# Altium schematic sheet Sheet1.SchDoc
size A4
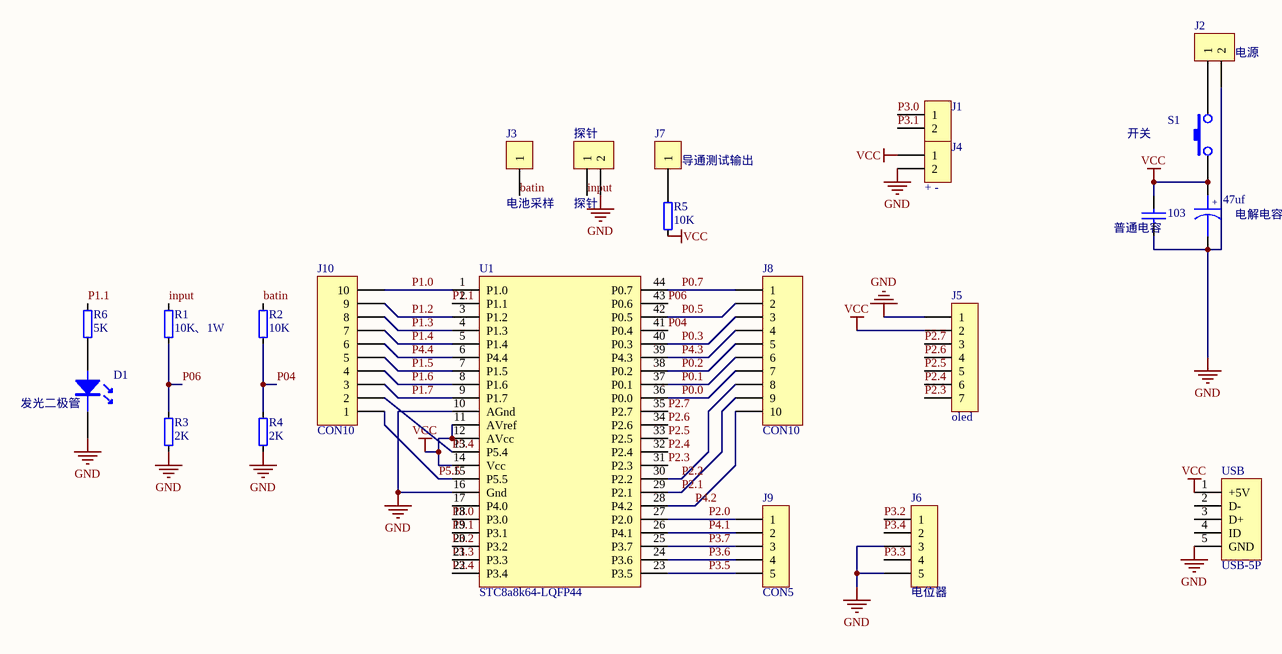
[diagram p0: Sheet1.SchDoc]

## Parts
47uf  电解电容  [电解电容直插]
103  普通电容  [瓷片电容直插]
D1  发光二极管  [LED]
J1  rxtx  [HDR2.54-LI-2P]
J2  电源  [HDR2.54-LI-2P]
J3  电池采样  [1pin排针]
J4  + -  [HDR2.54-LI-2P]
J5  oled  [7pin排针]
J6  电位器  [EC11]
J7  导通测试输出  [1pin排针]
J8  CON10  [HDR2.54-LI-10P]
J9  CON5  [HDR2.54-LI-5P]
J10  CON10  [HDR2.54-LI-10P]
R1  10K、1W  [直插电阻1/4W]
R2  10K  [直插电阻1/4W]
R3  2K  [直插电阻1/4W]
R4  2K  [直插电阻1/4W]
R5  10K  [直插电阻1/4W]
R6  5K  [直插电阻1/4W]
S1  开关  [SS-12D10]
U1  STC8a8k64-LQFP44  [TQFP44-10*10]
USB  USB-5P  [USB-micro_A]
探针  探针  [2pin-5mm]

## Nets
GND: 47uf.2 103.2 D1.K J2.2 J4.2 J5.1 J6.3 J6.5 R3.1 R4.1 U1.10(AGnd) U1.16(Gnd) USB.5(GND) 探针.2
VCC: 47uf.1 103.1 J4.1 J5.2 R5.1 S1.1 U1.11(AVref) U1.12(AVcc) U1.14(Vcc) USB.1(+5V)
batin: J3.1 R2.2
input: R1.2 探针.1
P0.0: J8.7 U1.36(P0.0)
P0.1: J8.6 U1.37(P0.1)
P0.2: J8.5 U1.38(P0.2)
P0.3: J8.3 U1.40(P0.3)
P0.5: J8.2 U1.42(P0.5)
P0.7: J8.1 U1.44(P0.7)
P1.0: J10.10 U1.1(P1.0)
P1.1: R6.2 U1.2(P1.1)
P1.2: J10.9 U1.3(P1.2)
P1.3: J10.8 U1.4(P1.3)
P1.4: J10.7 U1.5(P1.4)
P1.5: J10.5 U1.7(P1.5)
P1.6: J10.4 U1.8(P1.6)
P1.7: J10.3 U1.9(P1.7)
P2.0: J9.1 U1.27(P2.0)
P2.1: J8.9 U1.29(P2.1)
P2.2: J8.8 U1.30(P2.2)
P2.3: J5.7 U1.31(P2.3)
P2.4: J5.6 U1.32(P2.4)
P2.5: J5.5 U1.33(P2.5)
P2.6: J5.4 U1.34(P2.6)
P2.7: J5.3 U1.35(P2.7)
P3.0: J1.1 U1.18(P3.0)
P3.1: J1.2 U1.19(P3.1)
P3.2: J6.1 U1.20(P3.2)
P3.3: J6.4 U1.21(P3.3)
P3.4: J6.2 U1.22(P3.4)
P3.5: J9.5 U1.23(P3.5)
P3.6: J9.4 U1.24(P3.6)
P3.7: J9.3 U1.25(P3.7)
P04: R2.1 R4.2 U1.41(P0.4)
P4.1: J9.2 U1.26(P4.1)
P4.2: J8.10 U1.28(P4.2)
P4.3: J8.4 U1.39(P4.3)
P4.4: J10.6 U1.6(P4.4)
P5.4: J10.2 U1.13(P5.4)
P5.5: J10.1 U1.15(P5.5)
P06: R1.1 R3.2 U1.43(P0.6)
NetD1_A: D1.A R6.1
NetJ2_1: J2.1 S1.2
NetJ7_1: J7.1 R5.2

Not connected (* = marked no-connect by the designer): U1 17(P4.0); USB 2(D-) 3(D+) 4(ID)

## Notes on the sheet
- (in symbol 电解电容) +

## Library data of the parts
47uf = 电解电容: Capacitor
103 = 普通电容: Capacitor
J1 J2 J4 探针 = CON2: Connector
J3 J7 = CON1: Connector
J5 = CON7: Connector
J6 = CON5: Connector; pin to pad: 1>A 2>B 3>C 4>D 5>E
J8 J10 = CON10: Connector
J9 = CON5: Connector
R1-R6 = RES
S1 = 微动开关
U1 = STC8a8k64-LQFP44: STC单片机
USB = USB-5P: 微型USB母座; 版权归属: 源创客; BOM名称: 微型USB母座; 学习资源: www.ooocke.com